# Altium schematic sheet Voltage Source.SchDoc
size A3; SheetNumber: 3; SheetTotal: 6; ProjectTitle: DSP_VERSION_1.0
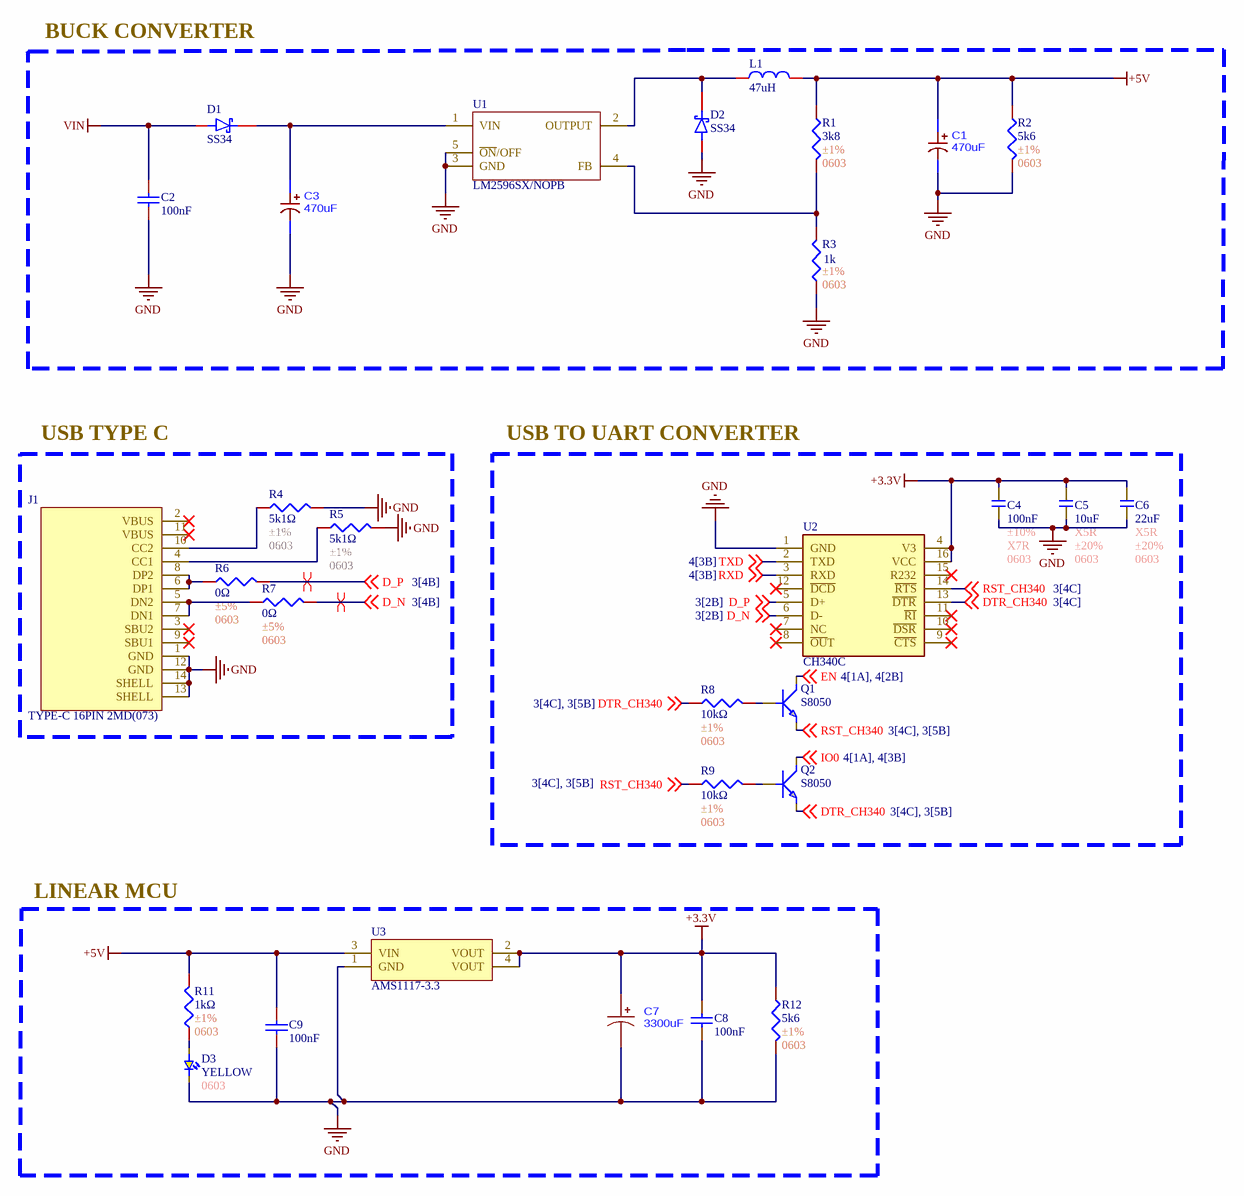
[diagram p0: Voltage Source.SchDoc]

## Parts
C1  470uF  [470uF 35V, D10xL13mm]
C2  100nF  [tu tantalum dip5.08]
C3  470uF  [470uF 35V, D10xL13mm]
C4  100nF  Tolerance: ±10%  Temperature Coefficient: X7R  Package: 0603  [C0603]
C5  10uF  Temperature Coefficient: X5R  Tolerance: ±20%  Package: 0603  [C0603]
C6  22uF  Temperature Coefficient: X5R  Tolerance: ±20%  Package: 0603  [C0603]
C7  3300uF  [Through Hole,D8xL16mm]
C8  100nF  [tu tantalum dip5.08]
C9  100nF  [tu tantalum dip5.08]
D1  SS34  [SS34]
D2  SS34  [SS34]
D3  YELLOW  Package: 0603  [LED0603]
J1  TYPE-C 16PIN 2MD(073)  [TYPE_C_FAMALE]
L1  47uH  [CD43]
Q1  S8050  [S8050]
Q2  S8050  [S8050]
R1  3k8  Tolerance: ±1%  Package: 0603  [R0603]
R2  5k6  Tolerance: ±1%  Package: 0603  [R0603]
R3  1k  Tolerance: ±1%  Package: 0603  [R0603]
R4  5k1Ω  Tolerance: ±1%  Package: 0603  [R0603]
R5  5k1Ω  Tolerance: ±1%  Package: 0603  [R0603]
R6  0Ω  Tolerance: ±5%  Package: 0603  [R0603]
R7  0Ω  Tolerance: ±5%  Package: 0603  [R0603]
R8  10kΩ  Tolerance: ±1%  Package: 0603  [R0603]
R9  10kΩ  Tolerance: ±1%  Package: 0603  [R0603]
R11  1kΩ  Tolerance: ±1%  Package: 0603  [R0603]
R12  5k6  Tolerance: ±1%  Package: 0603  [R0603]
U1  LM2596SX/NOPB  [LM2596SX-5.0/NOPB]
U2  CH340C  [CH340C]
U3  AMS1117-3.3  [AMS1117-3.3]

## Blocks framed on the sheet
BUCK CONVERTER: C1-C3 D1 D2 L1 R1-R3 U1
USB TYPE C: J1 R4-R7
USB TO UART CONVERTER: C4-C6 Q1 Q2 R8 R9 U2
LINEAR MCU: C7-C9 D3 R11 R12 U3

## Nets
+3.3V: C4.2 C5.2 C6.2 C7.1 C8.2 R12.1 U2.4(V3) U2.16(VCC) U3.2(VOUT) U3.4(VOUT)
+5V: C1.1 C9.2 L1.2 R1.1 R2.1 R11.2 U3.3(VIN)
GND: C1.2 C2.1 C3.2 C4.1 C5.1 C6.1 C7.2 C8.1 C9.1 D2.2 D3.1 J1.1(GND) J1.12(GND) J1.13(SHELL) J1.14(SHELL) R2.2 R3.1 R4.2 R5.2 R12.2 U1.3(GND) U1.5(~{ON}/OFF) U2.1(GND) U3.1(GND)
VIN: C2.2 D1.2
D_N: R7.2 U2.6(D-) ; off-sheet D_N
D_P: R6.2 U2.5(D+) ; off-sheet D_P
DTR_CH340: Q2.2(E) R8.1 U2.13(~{DTR}) ; off-sheet DTR_CH340
EN: Q1.3(C) ; off-sheet EN
IO0: Q2.3(C) ; off-sheet IO0
RST_CH340: Q1.2(E) R9.1 U2.14(~{RTS}) ; off-sheet RST_CH340
RXD: U2.3(RXD) ; off-sheet RXD
TXD: U2.2(TXD) ; off-sheet TXD
NetC3_1: C3.1 D1.1 U1.1(VIN)
NetD2_1: D2.1 L1.1 U1.2(OUTPUT)
NetD3_2: D3.2 R11.1
NetJ1_4: J1.4(CC1) R5.1
NetJ1_5: J1.5(DN2) J1.7(DN1) R7.1
NetJ1_6: J1.6(DP1) J1.8(DP2) R6.1
NetJ1_10: J1.10(CC2) R4.1
NetQ1_1: Q1.1(B) R8.2
NetQ2_1: Q2.1(B) R9.2
NetR1_2: R1.2 R3.2 U1.4(FB)

Not connected (* = marked no-connect by the designer): J1 2(VBUS)* 3(SBU2)* 9(SBU1)* 11(VBUS)*; U2 7(NC)* 8(~{OU}T)* 9(~{CTS})* 10(~{DSR})* 11(~{RI})* 12(~{DCD})* 15(R232)*

## Layout directives
differential pair: D_N, D_P

## Notes on the sheet
- Author:
- Title:
- Size:
- A3
- Project:
- Revision:
- Modified Date:
- CheckedBy:
- Date:
- SW Version:

## Library data of the parts
C1 C3 = 470uF  35V, D10xL13mm: 470uF ±20% 35V Through Hole,D10xL13mm; Manufacturer: AISHI; Mfr. Part #: SPZ1VM471G13O00RAXXX; Key Attributes: CAP ALUM POLY 470uF ±20% 35V TH; LCSC Part #: C2691847; Package: Through Hole,D10xL13mm; Link: https://www.lcsc.com/product-detail/C2691847.html
C2 C8 C9 = Tu tantalum 100nF 50V 20% DIP5.08: Cắm; Don_Vi: Con; So_Chan: 2; Ten_Linh_Kien: Tụ tantalum 104-100nF 50V 20% DIP5.08 (sứ vàng)(10PCS); Ma_Hang: MH003955; Chung_Loai: Cắm; Kieu_Chan: *
C4 = C0603_100nF_±10%_X7R: 50V 100nF X7R ±10% 0603 Multilayer Ceramic Capacitors MLCC - SMD/SMT ROHS; Manufacturer: YAGEO; Mfr. Part #: CC0603KRX7R9BB104; LCSC Part #: C14663; Capacitance: 100nF; Link: https://www.lcsc.com/product-detail/C14663.html?s_z=n_capital%25200603%2520100nf
C5 = C0603_10uF_±10%_X7R: 25V 10uF X5R ±20% 0603 Multilayer Ceramic Capacitors MLCC - SMD/SMT ROHS; Manufacturer: YAGEO; Mfr. Part #: CC0603MRX5R8BB106; LCSC Part #: C596327; Capacitance: 10uF; Link: https://www.lcsc.com/product-detail/C596327.html?s_z=n_capital%25200603%252010uF%2520yageo
C6 = C0603_22uF_±20%_X5R: 6.3V 22uF X5R ±20% 0603 Multilayer Ceramic Capacitors MLCC - SMD/SMT ROHS; Manufacturer: YAGEO; Mfr. Part #: CC0603MRX5R5BB226; LCSC Part #: C109448; ComponentLink1Description: New link; ComponentLink1URL: *; Capacitance: 22uF; Link: https://www.lcsc.com/product-detail/C109448.html?s_z=n_capital%25200603%252022uf%2520yageo
C7 = Through Hole,D8xL16mm: 3300uF ±20% 6.3V Through Hole,D8xL16mm 2000hrs; Manufacturer: Honor Elec; Mfr. Part #: HS0J338M0816PC; Key Attributes: CAP ALUM POLY 3300uF ±20% 6.3V TH; LCSC Part #: C5438512; Package: Through Hole,D8xL16mm; Link: https://www.lcsc.com/product-detail/C5438512.html
D1 D2 = SS34: 40V Independent 3A 550mV@3A SMA(DO-214AC) Schottky Diodes ROHS; Manufacturer: MDD(Microdiode Semiconductor); Mfr. Part #: SS34; LCSC Part #: C8678; Package: SMA(DO-214AC); Voltage - DC Reverse(Vr): 40V; Current - Rectified: 3A; Link: https://www.lcsc.com/product-detail/C8678.html?s_z=n_SS34
D3 = D0603_YELLOW: 25mcd~40mcd Water Clear -40℃~+85℃ 624nm Red 120° 60mW 0402 LED Indication - Discrete ROHS; Manufacturer: XINGLIGHT; Mfr. Part #: XL-1005UGC; Voltage - Forward(Vf): 3V; LCSC Part #: C965793; Power(Watts): 60mW; Link: https://www.lcsc.com/product-detail/C136765.html?s_z=n_LED%25200402%2520RED; Illumination Color: YELLOW
J1 = TYPE_C_FAMALE_16PIN: 3A 1 Surface Mount, Right Angle 16P Female -25℃~+85℃ Type-C SMD USB Connectors ROHS; Manufacturer: SHOU HAN; Mfr. Part #: TYPE-C 16PIN 2MD(073); LCSC Part #: C2765186; Package: SMD; Number of Contacts: 16P; Link: https://www.lcsc.com/product-detail/C2765186.html?s_z=n_type%2520c
L1 = CD4-10UH: 1.15A 10uH Unshielded Inductor ±20% SMD,4x4.5mm Power Inductors ROHS; Manufacturer: ZE; Mfr. Part #: CD43-100M; Key Attributes: FIXED IND 10uH 1.15A 182mΩ SMD,4x4.5mm; DC Resistance(DCR): 182mΩ; LCSC Part #: C18734467; Package: SMD,4x4.5mm; Link: https://www.lcsc.com/product-detail/C18734467.html?s_z=n_CD43%252010uH; Tolerance: ±20%; Current Rating: 1.15A; Inductance: 10uH
Q1 Q2 = S8050: 25V 300mW 500mA SOT-23 Bipolar (BJT) ROHS; Manufacturer: JSMSEMI; Key Attributes: TRANS 25V 500mA SOT-23; Transition frequency(fT): 150MHz; Vce Saturation(VCE(sat)): 600mV; Mfr. Part #: S8050; LCSC Part #: C916390; Package: SOT-23; Link: https://www.lcsc.com/product-detail/C916390.html?s_z=n_s8050; Current - Collector(Ic): 500mA
R1-R3 R12 = R0603_4k7Ω_±1%: 62.5mW Thick Film Resistor 50V ±1% ±200ppm/℃ 10Ω 0402 Chip Resistor - Surface Mount ROHS; Manufacturer: YAGEO; Mfr. Part #: RC0402FR-0710RL; Resistance: 4k7Ω; LCSC Part #: C138066; Link: https://www.lcsc.com/product-detail/C138066.html?s_z=n_resistor%25200402%252010R
R4 R5 = R0603_5k1Ω_±1%: 100mW Thick Film Resistor 75V ±100ppm/℃ ±1% 5.1kΩ 0603 Chip Resistor - Surface Mount ROHS; Manufacturer: FOJAN; Mfr. Part #: FRC0603F5101TS; Key Attributes: RES 5.1kΩ ±1% 100mW 0603; LCSC Part #: C2907044; Link: https://www.lcsc.com/product-detail/C2907044.html?s_z=n_5k1%25200603; Resistance: 5k1Ω
R6 R7 = R0603_0Ω_±5%: 100mW Thick Film Resistor 75V ±5% 0Ω 0603 Chip Resistor - Surface Mount ROHS; Manufacturer: YAGEO; Mfr. Part #: RC0603JR-070RL; Key Attributes: RES 0Ω ±5% 100mW 0603; LCSC Part #: C95177; Resistance: 0Ω; Link: https://www.lcsc.com/product-detail/C138066.html?s_z=n_resistor%25200402%252010R
R8 R9 = R0603_10kΩ_±1%: 62.5mW Thick Film Resistor 50V ±1% ±200ppm/℃ 10Ω 0402 Chip Resistor - Surface Mount ROHS; Manufacturer: YAGEO; Mfr. Part #: RC0402FR-0710RL; LCSC Part #: C138066; Resistance: 10kΩ; Link: https://www.lcsc.com/product-detail/C138066.html?s_z=n_resistor%25200402%252010R
R11 = R0603_1kΩ_±1%: 62.5mW Thick Film Resistor 50V ±1% ±200ppm/℃ 10Ω 0402 Chip Resistor - Surface Mount ROHS; Manufacturer: YAGEO; Mfr. Part #: RC0402FR-0710RL; LCSC Part #: C138066; Resistance: 1kΩ; Link: https://www.lcsc.com/product-detail/C138066.html?s_z=n_resistor%25200402%252010R
U1 = LM2596SX/NOPB: 150kHz Buck Fixed 1 TO-263-5 Voltage Regulators - DC DC Switching Regulators RoHS; Manufacturer: TI; Key Attributes: LM2596 SIMPLE SWITCHER 3A Step-Down Voltage Regulator; Mfr. Part #: LM2596SX/NOPB; LCSC Part #: C10002; Package: TO-263-5; Link: https://www.lcsc.com/product-detail/C10002.html?s_z=n_lm2596
U2 = CH340C: 2Mbps Transceiver USB 2.0 SOP-16 USB Converters ROHS; Manufacturer: WCH; Voltage - Supply: 3.3V;5V; LCSC Part #: C84681; Package: SOP-16; Link: https://www.lcsc.com/product-detail/C84681.html?s_z=n_CH340C; Mfr. Part #: CH340C
U3 = AMS1117-3.3: 72dB@(120Hz) 1A Fixed 3.3V Positive 16V SOT-223 Voltage Regulators - Linear, Low Drop Out (LDO) Regulators ROHS; Manufacturer: Advanced Monolithic Systems; LCSC Part #: C6186; Link: https://www.lcsc.com/product-detail/C6186.html?s_z=n_ams1117-3.3; Output Current: 1A; Package: SOT-223; Mfr. Part #: AMS1117-3.3